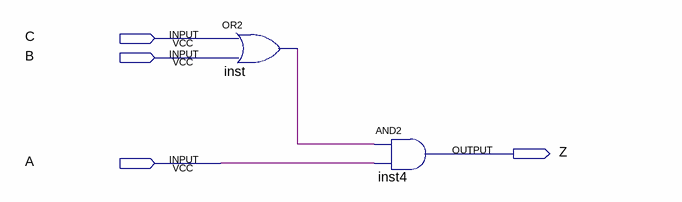
[diagram p0: schematic sheet]
// Quartus schematic lab13.bdf as structural Verilog: 2 symbols, 4 pins
module lab13 (
  input  C,
  input  B,
  input  A,
  output Z
);

  wire inst_out;

  or inst (inst_out, C, B);
  and inst4 (Z, inst_out, A);
endmodule
